# EAGLE design byle_cake (EAGLE 9.6.2)
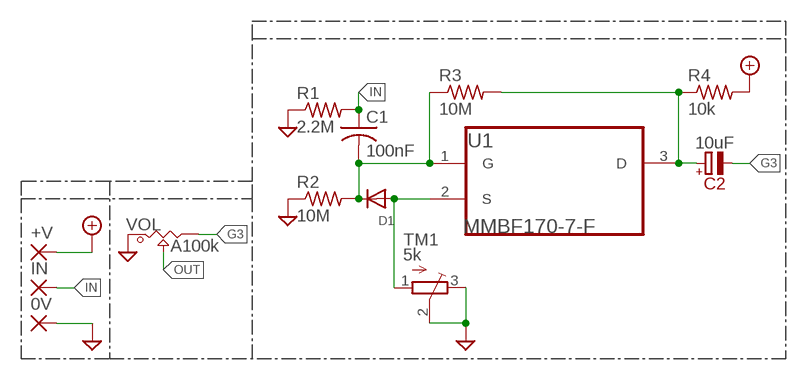
[diagram p0: schematic, sheet 1]

## Parts
0V  SMD2  [SMD1,27-2,54]
+V  SMD2  [SMD1,27-2,54]
C1  100nF  C-USC0603  [C0603]
C2  10uF  PAN_B  [PAN_B]
D1  DIODESOD-123  [SOD-123]
IN  SMD2  [SMD1,27-2,54]
R1  2.2M  R-US_R0603  [R0603]
R2  10M  R-US_R0603  [R0603]
R3  10M  R-US_R0603  [R0603]
R4  10k  R-US_R0603  [R0603]
TM1  5k  TRIMPOTTC33X  [TC33X]
U1  MMBF170-7-F  [SOT103P240X110-3N]
VOL  A100k  POT_9MM_SMD  [POT_9MM_SMD]

## Nets
+9V: +V.1(P) R4.2
G3: C2.2-(-) VOL.3
GND: 0V.1(P) R1.1 R2.1 TM1.2(S) TM1.3(E) VOL.1
IN: C1.1 IN.1(P) R1.2
N$1: C1.2 D1.C R2.2 R3.1 U1.1(G)
N$2: D1.A TM1.1(A) U1.2(S)
N$3: C2.1+(+) R3.2 R4.1 U1.3(D)
OUT: VOL.2

## Library data of the parts
0V +V IN = wirepad:SMD2: SMD PAD
C1 = adafruit:C-US: CAPACITOR, American symbol
C2 = Panasonic_ECap:PAN_B
D1 = adafruit:DIODE: Diode SMADIODE - SMA Surface Mount Package 20V 1A Schottky Diode Digikey: 641-1014-6-ND DO-1N4148 - Through Hole Small Current Diode SOD-123 20V 1 A (.5mV Vf) Schottky Diode - Digikey: MBRX120TPMSCT-ND SOD-323 10V 570mA (.38mV Vf, 3ns) Schottky Diode - Digikey: ZLLS410CT-ND SOD-523 30V 30mA Schottky Diode (RB751S-40TE61) - Digikey: RB751S-40TE61CT-ND SOT23-R/W - SOT23 Package (R = Solder Paste/Reflow Ovens, W = Hand-Soldering) BAT54Film 40V 300mA - Digikey: 497-7162-1-ND
R1-R4 = adafruit:R-US_: RESISTOR, American symbol
TM1 = adafruit:TRIMPOT: SMT trimmer potentiometer part number TC33X http://www.ladyada.net/library/eagle
U1 = MMBF170-7-F:MMBF170-7-F: N-CHANNEL ENHANCEMENT MODE FIELD EFFECT TRANSISTOR; AVAILABILITY: Unavailable; DESCRIPTION: N-Channel 60V 500mA _Ta_ 300mW _Ta_ Surface Mount SOT-23-3; MF: Diodes Inc.; MP: MMBF170-7-F; PACKAGE: SOT-23-3 Diodes Inc.; PRICE: None
VOL = Mech_BO_CE_SW:POT_9MM_SMD

## Board
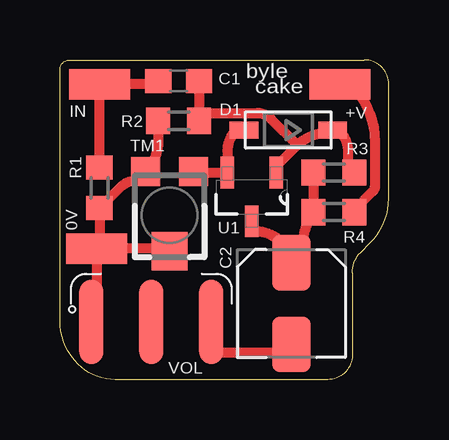
[diagram p1: board, top side]

Size 13.72 x 13.34 mm. Coordinates in mm from the lower left corner, seen from the top.
Outline: 13.72,7.55 13.72,12.32 arc90 12.7,13.34 0.41,13.34 arc90 0,12.93 0,2.48 arc45 0.76,0.64 arc45 2.29,0 11.18,0 arc90 12.19,1.02 12.19,4.45 arc-45 12.55,5.31 12.95,5.71 arc45 13.72,7.55
Copper layers (1*16): Top 0.035mm / dielectric 1.5mm / Bottom 0.035mm
Design rules "default *": minimum track width 6mil, minimum drill 0.35mm, track to track 6mil, track to pad 6mil, pad to pad 6mil, via to via 6mil, smd to smd 6mil, copper to edge 10mil, drill to drill 6mil, minimum pad ring 10mil, minimum via ring 8mil, stop-mask expansion 4mil, vias tented up to drill 0mil, thermal gap 10mil

### Footprints (pad centres in the part's own frame; a part is rotated, then mirrored left to right if it is on the bottom)
SMD1,27-2,54 = smd 1.27 x 2.54: 1 0,0
C0603 = smd 1.1 x 1: 1 -0.85,0; 2 0.85,0
PAN_B = smd 2.312 x 1.6: 1+ -1.7,0; 2- 1.7,0
SOD-123 = smd 1.2 x 0.7: A 1.85,0; C -1.85,0
R0603 = smd 1 x 1.1: 1 -0.85,0; 2 0.85,0
TC33X = smd 1.2 x 1.2: 1 -1,-1.825; 3 1,-1.825 | smd 1.5 x 1.6: 2 0,1.5
SOT103P240X110-3N = smd 1.321 x 0.559: 1 -1.016,1.016; 2 -1.016,-1.016; 3 1.016,0
POT_9MM_SMD = smd 0.991 x 3.505: 1 -2.5,0; 2 0,0; 3 2.5,0

### Placement (x,y rotation side)
0V  1.52,5.46 90 top
+V  11.68,12.32 90 top
C1  4.95,12.45 0 top
C2  9.65,3.17 270 top
D1  9.53,10.41 180 top
IN  1.65,12.32 90 top
R1  1.65,8 90 top
R2  4.95,10.79 0 top
R3  11.43,8.64 180 top
R4  11.43,6.99 0 top
TM1  4.57,6.86 180 top
U1  8,7.62 270 top
VOL  3.81,2.41 0 top

### Tracks (layer width: path | path; a pad name or v marks a point on that pad's centre or on a via)
+9V
  Top 0.406: R4.2 12.28,7.08 13.06,7.86 arc45 13.14,8.04 13.14,9.91 arc45 12.14,12.32 +V.1
G3
  Top 0.406: VOL.3 6.48,2.25 6.48,1.14 9.32,1.14 C2.2-
GND
  Top 0.406: 0V.1 1.65,5.59 R1.1 2.53,8.03 arc-45 3.19,8.3 TM1.3 arc45 4.1,9.96 R2.1 | 0V.1 1.52,2.63 VOL.1 | TM1.2 4.47,5.46 0V.1
IN
  Top 0.406: R1.2 IN.1 3.98,12.32 C1.1
N$1
  Top 0.406: 9.91,9.77 arc-45 11.15,10.29 11.25,10.29 D1.C 11.64,10.41 arc-45 12.03,9.49 12.03,8.89 R3.1 | U1.1 9.02,8.88 9.91,9.77 | C1.2 R2.2 5.84,10.79 6.17,11.12 8.25,11.12 arc-45 8.79,10.9 9.91,9.77
N$2
  Top 0.406: TM1.1 5.62,8.64 U1.2 6.99,9.54 arc-45 7.35,10.41 D1.A
N$3
  Top 0.406: R3.2 R4.1 10.58,6.86 arc45 10.16,5.84 10.16,4.83 9.65,5.33 | C2.1+ 9.65,5.33 | U1.3 8,6.35 8.16,6.19 arc-45 9.25,5.74 9.65,5.33

### Text on the board
tPlace: byle | cake